# EAGLE schematic vrx (EAGLE 8.3.2)
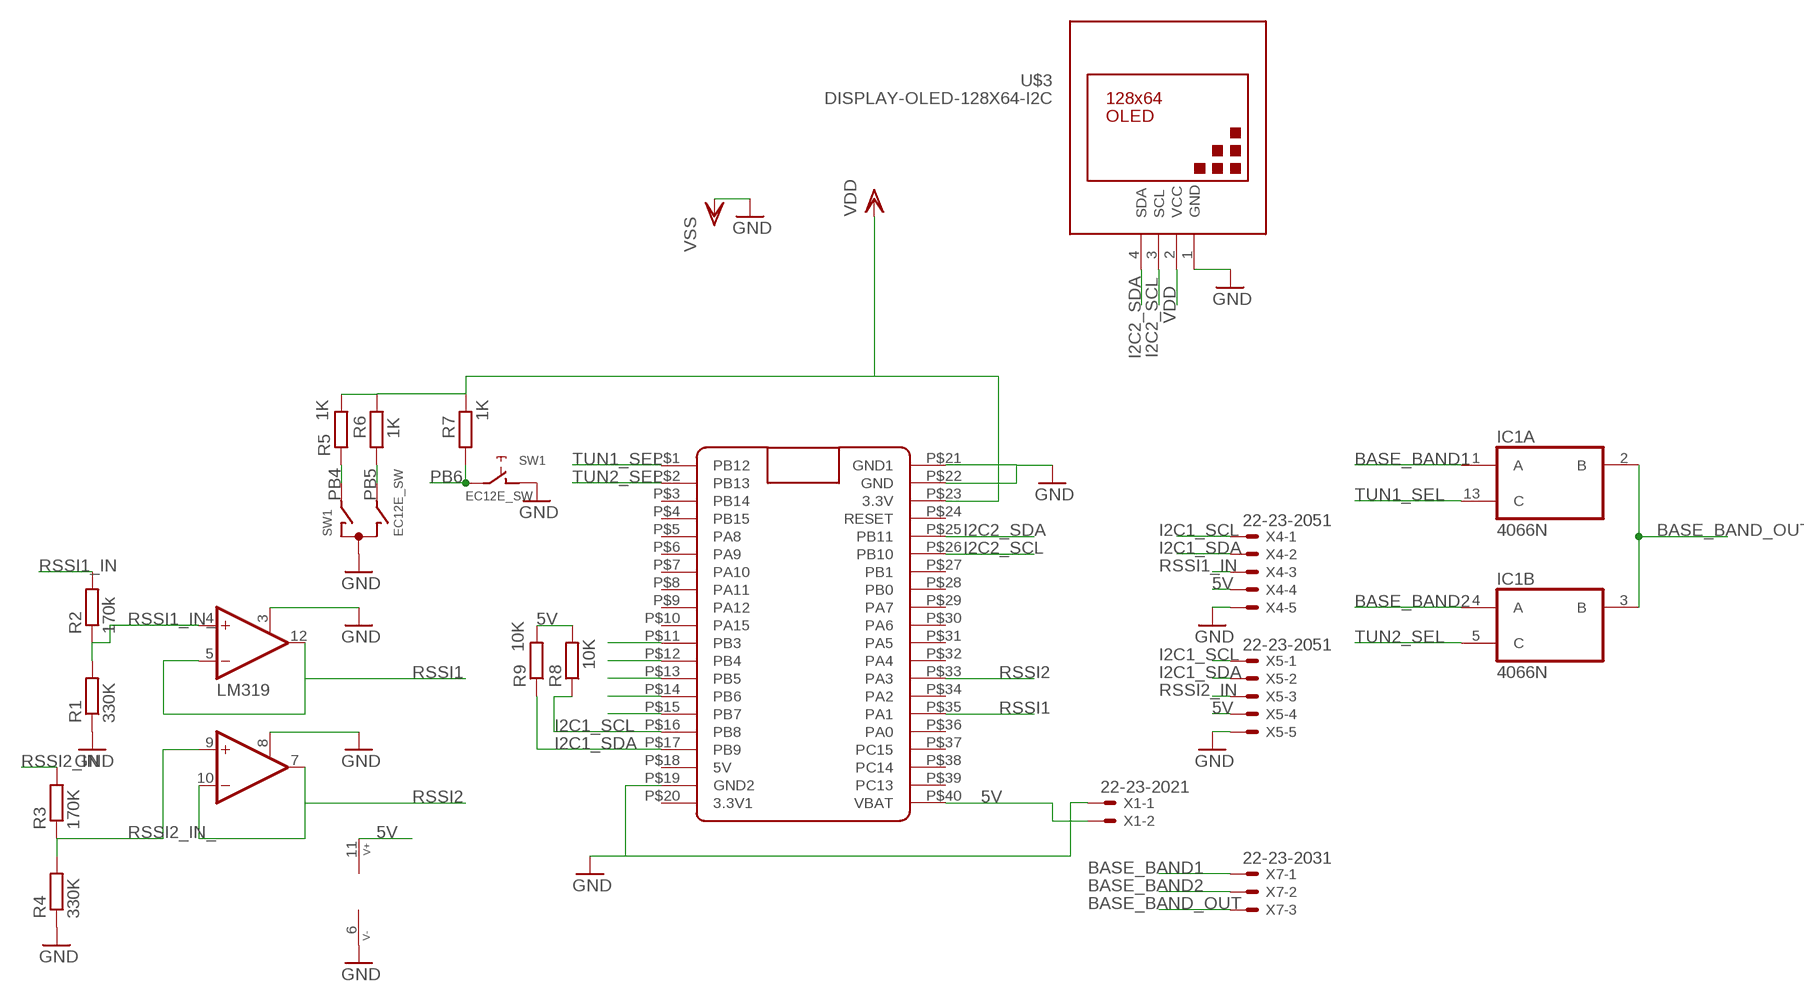
[diagram p0: schematic, sheet 1]

## Parts
IC1  4066N  [DIL14]
R1  330K  R-EU_0204/7  [0204/7]
R2  170k  R-EU_0204/7  [0204/7]
R3  170K  R-EU_0204/7  [0204/7]
R4  330K  R-EU_0204/7  [0204/7]
R5  1K  R-EU_0204/7  [0204/7]
R6  1K  R-EU_0204/7  [0204/7]
R7  1K  R-EU_0204/7  [0204/7]
R8  10K  R-EU_0204/7  [0204/7]
R9  10K  R-EU_0204/7  [0204/7]
SW1  EC12E_SW  [ALPS_EC12E_SW]
U$1  BLUE_PILLADVANCED  [BLUE_PILL_ADV]
U$2  LM319  [DIL14]
U$3  DISPLAY-OLED-128X64-I2C  [DISPLAY-OLED-128X64-I2C]
X1  22-23-2021  [22-23-2021]
X4  22-23-2051  [22-23-2051]
X5  22-23-2051  [22-23-2051]
X7  22-23-2031  [22-23-2031]

## Nets
5V: R8.2 R9.2 U$1.P$40(VBAT) U$2.11(V+) X1.2 X4.4 X5.4
BASE_BAND1: IC1.1(A:A) X7.1
BASE_BAND2: IC1.4(B:A) X7.2
BASE_BAND_OUT: IC1.2(A:B) IC1.3(B:B) X7.3
GND: R1.1 R4.1 SW1.C SW1.D U$1.P$19(GND2) U$1.P$21(GND1) U$1.P$22(GND) U$2.3(SHDN) U$2.6(V-) U$2.8(SHDN) U$3.1(GND) X1.1 X4.5 X5.5 ; supply symbol labelled VSS
I2C1_SCL: R8.1 U$1.P$16(PB8) X4.1 X5.1
I2C1_SDA: R9.1 U$1.P$17(PB9) X4.2 X5.2
I2C2_SCL: U$1.P$26(PB10) U$3.3(SCL)
I2C2_SDA: U$1.P$25(PB11) U$3.4(SDA)
PB3: U$1.P$11(PB3)
PB4: R5.1 SW1.A U$1.P$12(PB4)
PB5: R6.1 SW1.B U$1.P$13(PB5)
PB6: R7.1 SW1.E U$1.P$14(PB6)
PB7: U$1.P$15(PB7)
RSSI1: U$1.P$35(PA1) U$2.5(-IN) U$2.12(OUT)
RSSI1_IN: R2.2 X4.3
RSSI1_IN_: R1.2 R2.1 U$2.4(+IN)
RSSI2: U$1.P$33(PA3) U$2.7(OUT) U$2.10(-IN)
RSSI2_IN: R3.2 X5.3
RSSI2_IN_: R3.1 R4.2 U$2.9(+IN)
TUN1_SEL: IC1.13(A:C) U$1.P$1(PB12)
TUN2_SEL: IC1.5(B:C) U$1.P$2(PB13)
VDD: R5.2 R6.2 R7.2 U$1.P$23(3.3V) U$3.2(VCC)
Unconnected: IC1.6(C:C) IC1.8(C:A) IC1.9(C:B) IC1.10(D:B) IC1.11(D:A) IC1.12(D:C) SW1.GND1(G) SW1.GND2(G) U$1.P$3(PB14) U$1.P$4(PB15) U$1.P$5(PA8) U$1.P$6(PA9) U$1.P$7(PA10) U$1.P$8(PA11) U$1.P$9(PA12) U$1.P$10(PA15) U$1.P$18(5V) U$1.P$20(3.3V1) U$1.P$24(RESET) U$1.P$27(PB1) U$1.P$28(PB0) U$1.P$29(PA7) U$1.P$30(PA6) U$1.P$31(PA5) U$1.P$32(PA4) U$1.P$34(PA2) U$1.P$36(PA0) U$1.P$37(PC15) U$1.P$38(PC14) U$1.P$39(PC13)

## Power pins joined to a net without a drawn wire
VDD: IC1.14(P:VDD)
VSS: IC1.7(P:VSS)

## Library data of the parts
IC1 = 40xx:4066: Quad bilateral ANALOG SWITCH
R1-R9 = rcl:R-EU_: RESISTOR, European symbol
SW1 = switch-alps:EC12E_SW: ALPS rotary Encoder EC12E series with switch; MPN: EC12E2424407; OC_FARNELL: 1520813; OC_NEWARK: 74M1068
U$1 = BluePill:BLUE_PILL
U$2 = op-amp:LM319
U$3 = diy-modules:DISPLAY-OLED-128X64-I2C: 128x64 Dot Matrix OLED Module based on SSD1306 chip Variant with I2C interface More details available here: http://www.instructables.com/id/Monochrome-096-i2c-OLED-display-with-arduino-SSD13/ SSD1306 datasheet: https://cdn-shop.adafruit.com/datasheets/SSD1306.pdf Click here to find device on ebay.com <http://www.ebay.com/sch/oled+display+128x64+iic> Note: There are two variants: I2C and SPI. Search for the proper version.
X1 = con-molex:22-23-2021: .100" (2.54mm) Center Header - 2 Pin; MF: MOLEX; MPN: 22-23-2021; OC_FARNELL: 1462926; OC_NEWARK: 25C3832
X4 X5 = con-molex:22-23-2051: .100" (2.54mm) Center Header - 5 Pin; MF: MOLEX; MPN: 22-23-2051; OC_FARNELL: 1462952; OC_NEWARK: 38C9178
X7 = con-molex:22-23-2031: .100" (2.54mm) Center Header - 3 Pin; MF: MOLEX; MPN: 22-23-2031; OC_FARNELL: 1462950; OC_NEWARK: 30C0862